# EAGLE design 4ButtonSwitch.Rev2.2 (EAGLE 8.6.0)
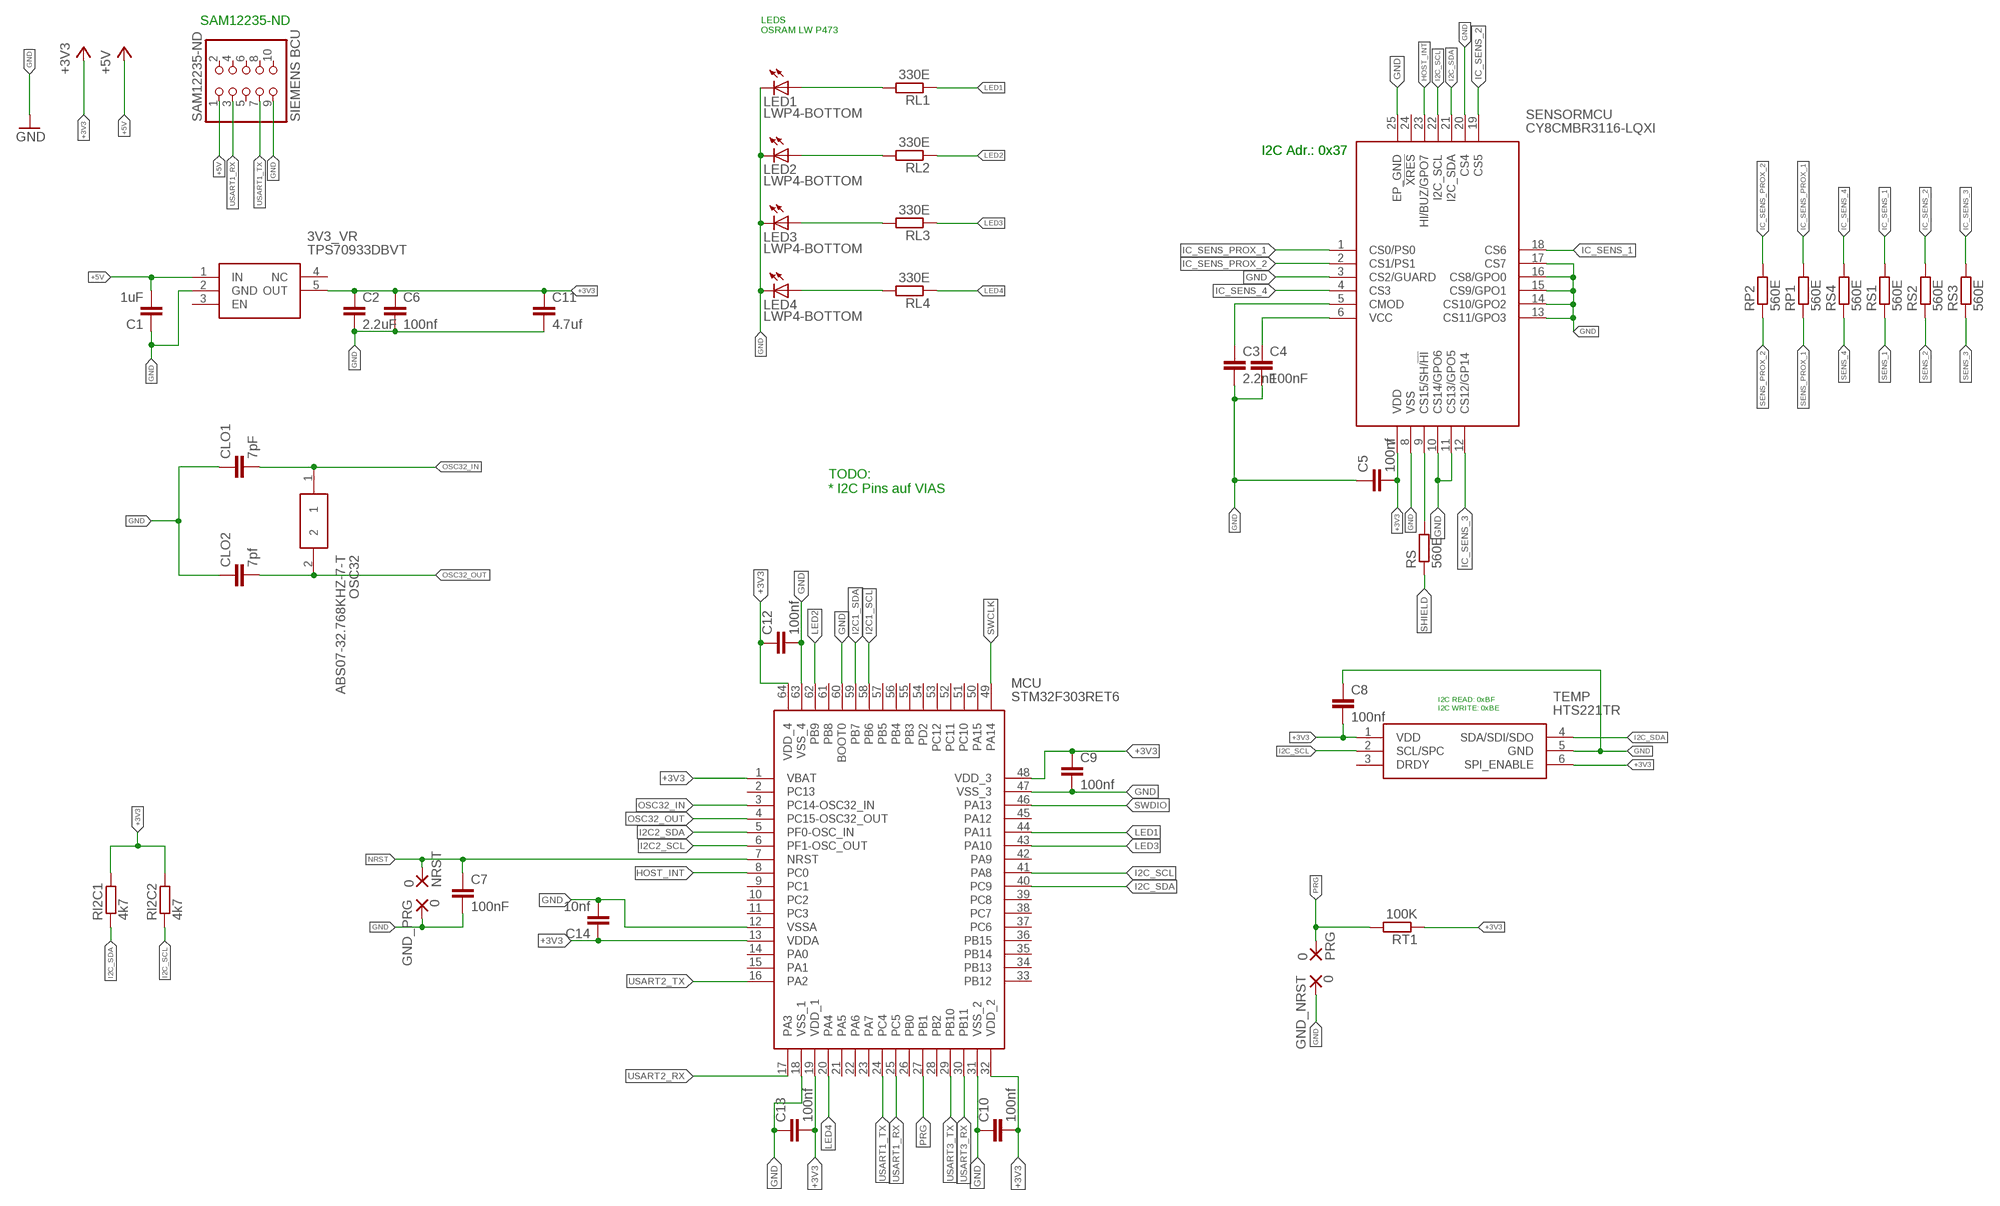
[diagram p0: schematic, sheet 1]

## Parts
3V3_VR  TPS70933DBVT  [SOT95P280X145-5N]
C1  1uF  C-EUC0402  [C0402]
C2  2.2uF  C-EUC0402  [C0402]
C3  2.2nF  C-EUC0402  [C0402]
C4  100nF  C-EUC0402  [C0402]
C5  100nf  C-EUC0402  [C0402]
C6  100nf  C-EUC0402  [C0402]
C7  100nF  C-EUC0402  [C0402]
C8  100nf  C-EUC0402  [C0402]
C9  100nf  C-EUC0402  [C0402]
C10  100nf  C-EUC0402  [C0402]
C11  4.7uf  C-EUC0402  [C0402]
C12  100nf  C-EUC0402  [C0402]
C13  100nf  C-EUC0402  [C0402]
C14  10nf  C-EUC0402  [C0402]
CLO1  7pF  C-EUC0402  [C0402]
CLO2  7pf  C-EUC0402  [C0402]
GND_NRST  0  SMD5  [SMD2,54-5,08]
GND_PRG  0  SMD5  [SMD2,54-5,08]
LED1  LWP4-BOTTOM  [P47F-BOTTOM]
LED2  LWP4-BOTTOM  [P47F-BOTTOM]
LED3  LWP4-BOTTOM  [P47F-BOTTOM]
LED4  LWP4-BOTTOM  [P47F-BOTTOM]
MCU  STM32F303RET6  [QFP50P1200X1200X160-64N]
NRST  0  SMD5  [SMD2,54-5,08]
OSC32  ABS07-32.768KHZ-7-T  [ABS-07]
PRG  0  SMD5  [SMD2,54-5,08]
RI2C1  4k7  R-EU_R0402  [R0402]
RI2C2  4k7  R-EU_R0402  [R0402]
RL1  330E  R-EU_R0402  [R0402]
RL2  330E  R-EU_R0402  [R0402]
RL3  330E  R-EU_R0402  [R0402]
RL4  330E  R-EU_R0402  [R0402]
RP1  560E  R-EU_R0402  [R0402]
RP2  560E  R-EU_R0402  [R0402]
RS  560E  R-EU_R0402  [R0402]
RS1  560E  R-EU_R0402  [R0402]
RS2  560E  R-EU_R0402  [R0402]
RS3  560E  R-EU_R0402  [R0402]
RS4  560E  R-EU_R0402  [R0402]
RT1  100K  R-EU_R0402  [R0402]
SAM12235-ND  SIEMENS BCU  PINHD-2X5_2.54-SMD  [2X05SMD]
SENSORMCU  CY8CMBR3116-LQXI  [QFN50P400X400X60-25N]
TEMP  HTS221TR  [HLGA-6L]

## Nets
+3V3: 3V3_VR.5(OUT) C2.1 C5.2 C6.1 C8.2 C9.1 C10.2 C11.1 C12.1 C13.2 C14.1 MCU.1(VBAT) MCU.13(VDDA) MCU.19(VDD_1) MCU.32(VDD_2) MCU.48(VDD_3) MCU.64(VDD_4) RI2C1.2 RI2C2.2 RT1.1 SENSORMCU.7(VDD) TEMP.1(VDD) TEMP.6(SPI_ENABLE)
+5V: 3V3_VR.1(IN) C1.2 SAM12235-ND.1
CMOD: C3.1 SENSORMCU.5(CMOD)
GND: 3V3_VR.2(GND) C1.1 C2.2 C3.2 C4.2 C5.1 C6.2 C7.2 C8.1 C9.2 C10.1 C11.2 C12.2 C13.1 C14.2 CLO1.1 CLO2.1 GND_NRST.1(P) GND_PRG.1(P) LED1.C LED2.C LED3.C LED4.C MCU.12(VSSA) MCU.18(VSS_1) MCU.31(VSS_2) MCU.47(VSS_3) MCU.60(BOOT0) MCU.63(VSS_4) SAM12235-ND.9 SENSORMCU.3(CS2/GUARD) SENSORMCU.8(VSS) SENSORMCU.10(CS14/GPO6) SENSORMCU.11(CS13/GPO5) SENSORMCU.13(CS11/GPO3) SENSORMCU.14(CS10/GPO2) SENSORMCU.15(CS9/GPO1) SENSORMCU.16(CS8/GPO0) SENSORMCU.17(CS7) SENSORMCU.20(CS4) SENSORMCU.25(EP_GND) TEMP.5(GND)
HOST_INT: MCU.8(PC0) SENSORMCU.23(HI/BUZ/GPO7)
I2C1_SCL: MCU.58(PB6)
I2C1_SDA: MCU.59(PB7)
I2C2_SCL: MCU.6(PF1-OSC_OUT)
I2C2_SDA: MCU.5(PF0-OSC_IN)
I2C_SCL: MCU.41(PA8) RI2C2.1 SENSORMCU.22(I2C_SCL) TEMP.2(SCL/SPC)
I2C_SDA: MCU.40(PC9) RI2C1.1 SENSORMCU.21(I2C_SDA) TEMP.4(SDA/SDI/SDO)
IC_SENS_1: RS1.2 SENSORMCU.18(CS6)
IC_SENS_2: RS2.2 SENSORMCU.19(CS5)
IC_SENS_3: RS3.2 SENSORMCU.12(CS12/GP14)
IC_SENS_4: RS4.2 SENSORMCU.4(CS3)
IC_SENS_PROX_1: RP1.2 SENSORMCU.1(CS0/PS0)
IC_SENS_PROX_2: RP2.2 SENSORMCU.2(CS1/PS1)
LED1: MCU.44(PA11) RL1.1
LED2: MCU.62(PB9) RL2.1
LED3: MCU.43(PA10) RL3.1
LED4: MCU.20(PA4) RL4.1
N$1: RS.2 SENSORMCU.9(CS15/SH/!HI)
N$19: LED1.A RL1.2
N$20: LED2.A RL2.2
N$21: LED3.A RL3.2
N$22: LED4.A RL4.2
NRST: C7.1 MCU.7(NRST) NRST.1(P)
OSC32_IN: CLO1.2 MCU.3(PC14-OSC32_IN) OSC32.1
OSC32_OUT: CLO2.2 MCU.4(PC15-OSC32_OUT) OSC32.2
PRG: MCU.27(PB1) PRG.1(P) RT1.2
SENS_1: RS1.1
SENS_2: RS2.1
SENS_3: RS3.1
SENS_4: RS4.1
SENS_PROX_1: RP1.1
SENS_PROX_2: RP2.1
SHIELD: RS.1
SWCLK: MCU.49(PA14)
SWDIO: MCU.46(PA13)
USART1_RX: MCU.25(PC5) SAM12235-ND.3
USART1_TX: MCU.24(PC4) SAM12235-ND.7
USART2_RX: MCU.17(PA3)
USART2_TX: MCU.16(PA2)
USART3_RX: MCU.30(PB11)
USART3_TX: MCU.29(PB10)
VCC: C4.1 SENSORMCU.6(VCC)
Unconnected: 3V3_VR.3(EN) 3V3_VR.4(NC) MCU.2(PC13) MCU.9(PC1) MCU.10(PC2) MCU.11(PC3) MCU.14(PA0) MCU.15(PA1) MCU.21(PA5) MCU.22(PA6) MCU.23(PA7) MCU.26(PB0) MCU.28(PB2) MCU.33(PB12) MCU.34(PB13) MCU.35(PB14) MCU.36(PB15) MCU.37(PC6) MCU.38(PC7) MCU.39(PC8) MCU.42(PA9) MCU.45(PA12) MCU.50(PA15) MCU.51(PC10) MCU.52(PC11) MCU.53(PC12) MCU.54(PD2) MCU.55(PB3) MCU.56(PB4) MCU.57(PB5) MCU.61(PB8) SAM12235-ND.2 SAM12235-ND.4 SAM12235-ND.5 SAM12235-ND.6 SAM12235-ND.8 SAM12235-ND.10 SENSORMCU.24(!XRES) TEMP.3(DRDY)

## Notes on the sheet
- SAM12235-ND
- LEDS
  OSRAM LW P473
- I2C Adr.: 0x37 | I2C Adr.: 0x37
- TODO:
  * I2C Pins auf VIAS
- I2C READ: 0xBF
  I2C WRITE: 0xBE

## Library data of the parts
3V3_VR = TPS70933DBVT:TPS70933DBVT: 150mA 30V Ultra-Low-Iq Wide-Input Low-Dropout (LDO) Regulator With Reverse Current Protection Source: Datasheet <http://www.ti.com/lit/gpn/tps709>; ARROW_PART_NUMBER: TPS70933DBVT; ARROW_PRICE-STOCK: https://www.arrow.com/en/products/tps70933dbvt/texas-instruments; DESCRIPTION: 150mA 30V Ultra-Low-Iq Wide-Input Low-Dropout (LDO) Regulator With Reverse Current Protection; HEIGHT: 1.45mm; MANUFACTURER_NAME: Texas Instruments; MANUFACTURER_PART_NUMBER: TPS70933DBVT; RS_PART_NUMBER: 8257033P; RS_PRICE-STOCK: http://uk.rs-online.com/web/p/products/8257033P
C1-C14 CLO1 CLO2 = rcl:C-EU: CAPACITOR, European symbol; SPICEPREFIX: C
GND_NRST GND_PRG NRST PRG = wirepad:SMD5: SMD PAD
LED1-LED4 = led:*P4: PointLED® Enhanced Thinfilm LED TOP & BOTTOM mount LS P47F, LR P47F, LA P47F, LY P47F, LT P4SG, LB P4SG, LW P4SG Source: http://catalog.osram-os.com .. LA_LR_LS_LY_P47F_Pb_free.pdf
MCU = STM32F303RET6:STM32F303RET6: MCU+FPU 32-Bit Cortex-M4 512KB LQFP64 Source: Datasheet <http://www.st.com/content/ccc/resource/technical/document/datasheet/2c/6f/d7/64/1f/a3/4f/c9/DM00118585.pdf/files/DM00118585.pdf/jcr:content/translations/en.DM00118585.pdf>; ARROW_PART_NUMBER: STM32F303RET6; ARROW_PRICE/STOCK: https://www.arrow.com/en/products/stm32f303ret6/stmicroelectronics; DESCRIPTION: MCU+FPU 32-Bit Cortex-M4 512KB LQFP64; HEIGHT: 1.6mm; MANUFACTURER_NAME: STMicroelectronics; MANUFACTURER_PART_NUMBER: STM32F303RET6; RS_PART_NUMBER: 1458887; RS_PRICE/STOCK: http://uk.rs-online.com/web/p/products/1458887
OSC32 = ABS07-32.768KHZ-7-T:ABS07-32.768KHZ-7-T: ABRACON - ABS07-32.768KHZ-7-T - CRYSTAL, 32.768KHZ, 7PF, SMD Source: Datasheet <https://componentsearchengine.com/Datasheets/2/ABS07-32.768KHZ-7-T.pdf>; ARROW_PART_NUMBER: ABS07-32.768KHZ-7-T; ARROW_PRICE/STOCK: https://www.arrow.com/en/products/abs07-32.768khz-7-t/abracon; DESCRIPTION: ABRACON - ABS07-32.768KHZ-7-T - CRYSTAL, 32.768KHZ, 7PF, SMD; HEIGHT: mm; MANUFACTURER_NAME: ABRACON; MANUFACTURER_PART_NUMBER: ABS07-32.768KHZ-7-T; RS_PART_NUMBER: 1712773P; RS_PRICE/STOCK: http://uk.rs-online.com/web/p/products/1712773P
RI2C1 RI2C2 RL1-RL4 RP1 RP2 RS RS1-RS4 RT1 = resistor:R-EU_: RESISTOR, European symbol
SAM12235-ND = pinhead:PINHD-2X5: PIN HEADER
SENSORMCU = CY8CMBR3116-LQXI:CY8CMBR3116-LQXI: Touch Screen Controllers CapSense Express 16 Buttons Source: Datasheet <http://www.cypress.com/file/46236/download.pdf>; ARROW_PART_NUMBER: CY8CMBR3116-LQXI; ARROW_PRICE/STOCK: https://www.arrow.com/en/products/cy8cmbr3116-lqxi/cypress-semiconductor; DESCRIPTION: Touch Screen Controllers CapSense Express 16 Buttons; HEIGHT: 0.6mm; MANUFACTURER_NAME: Cypress Semiconductor; MANUFACTURER_PART_NUMBER: CY8CMBR3116-LQXI; RS_PART_NUMBER: 1242976P; RS_PRICE/STOCK: http://uk.rs-online.com/web/p/products/1242976P
TEMP = HTS221TR:HTS221TR: Humidity and Temperature Sensor HLGA6 STMicroelectronics HTS221TR Temperature & Humidity Sensor, -40 +120 C, 6-Pin HLGA Source: Datasheet <http://www.st.com/content/ccc/resource/technical/document/datasheet/4d/9a/9c/ad/25/07/42/34/DM00116291.pdf/files/DM00116291.pdf/jcr:content/translations/en.DM00116291.pdf>; ARROW_PART_NUMBER: HTS221TR; ARROW_PRICE/STOCK: https://www.arrow.com/en/products/hts221tr/stmicroelectronics; DESCRIPTION: Humidity and Temperature Sensor HLGA6 STMicroelectronics HTS221TR Temperature & Humidity Sensor, -40 +120 C, 6-Pin HLGA; HEIGHT: mm; MANUFACTURER_NAME: STMicroelectronics; MANUFACTURER_PART_NUMBER: HTS221TR; RS_PART_NUMBER: 1660935; RS_PRICE/STOCK: http://uk.rs-online.com/web/p/products/1660935

## Board
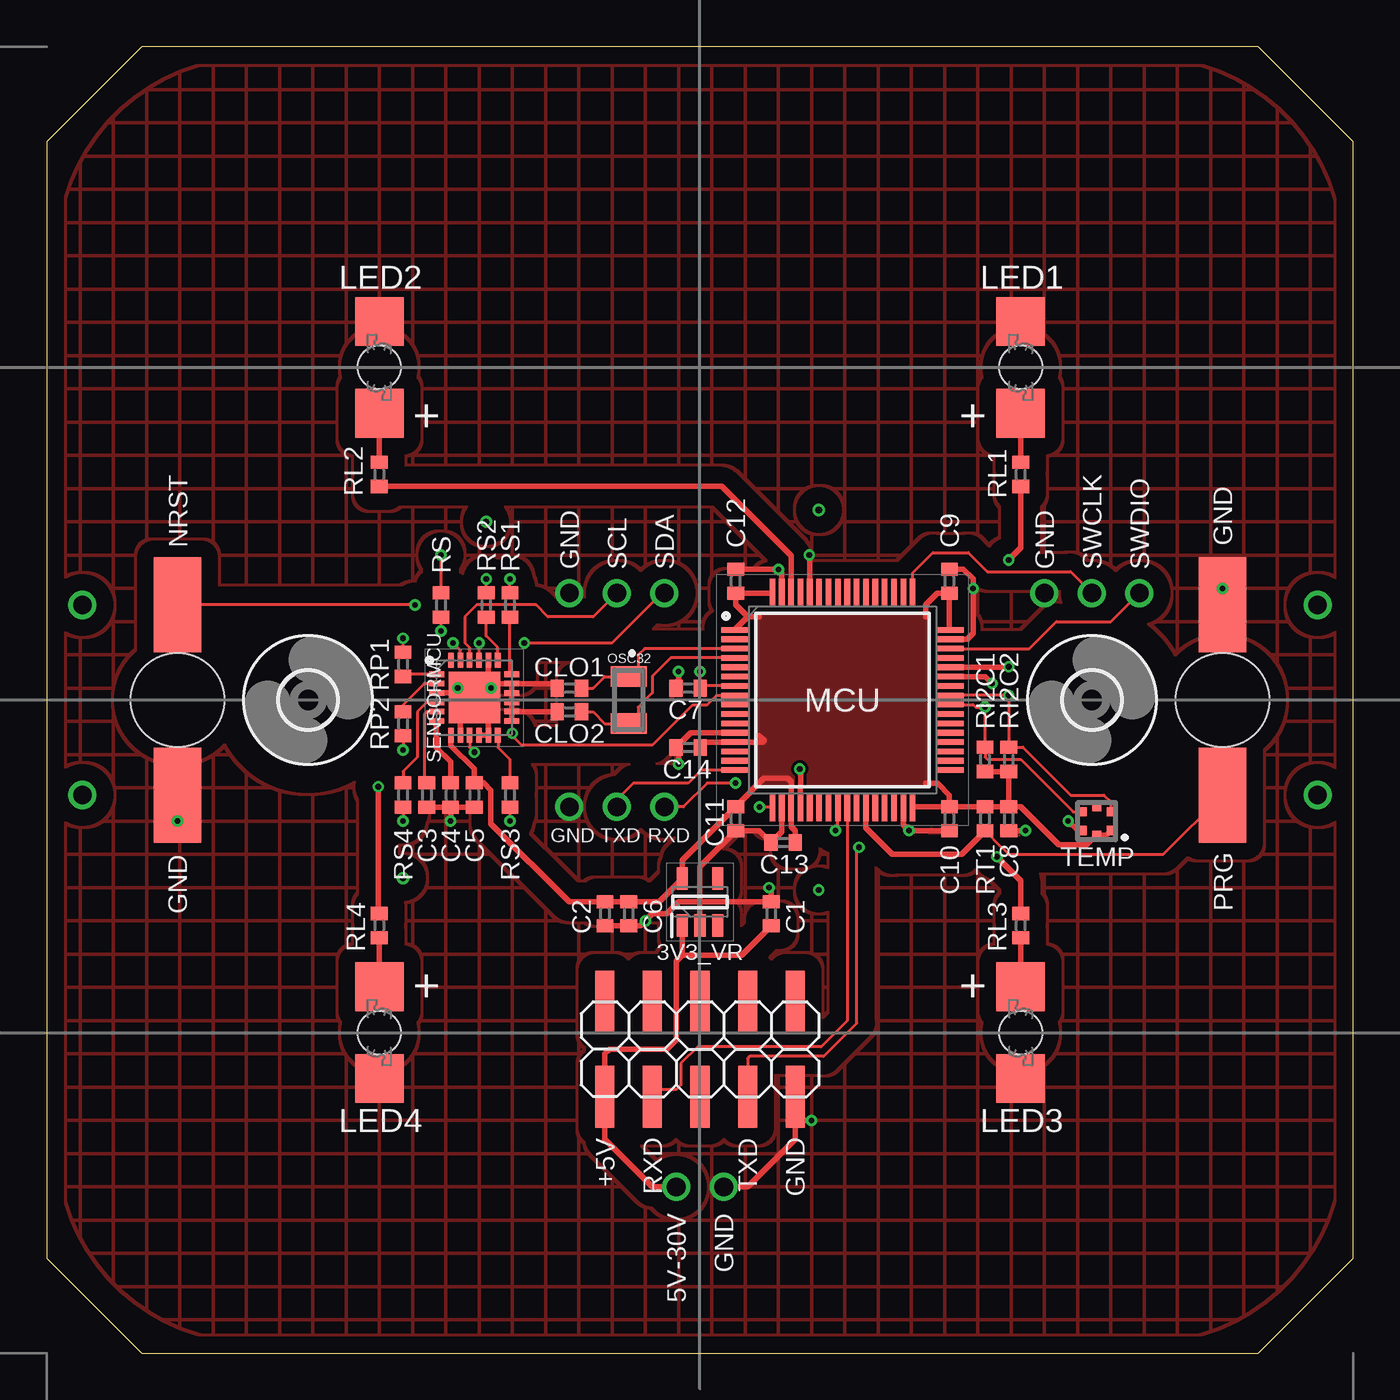
[diagram p1: board, top side]
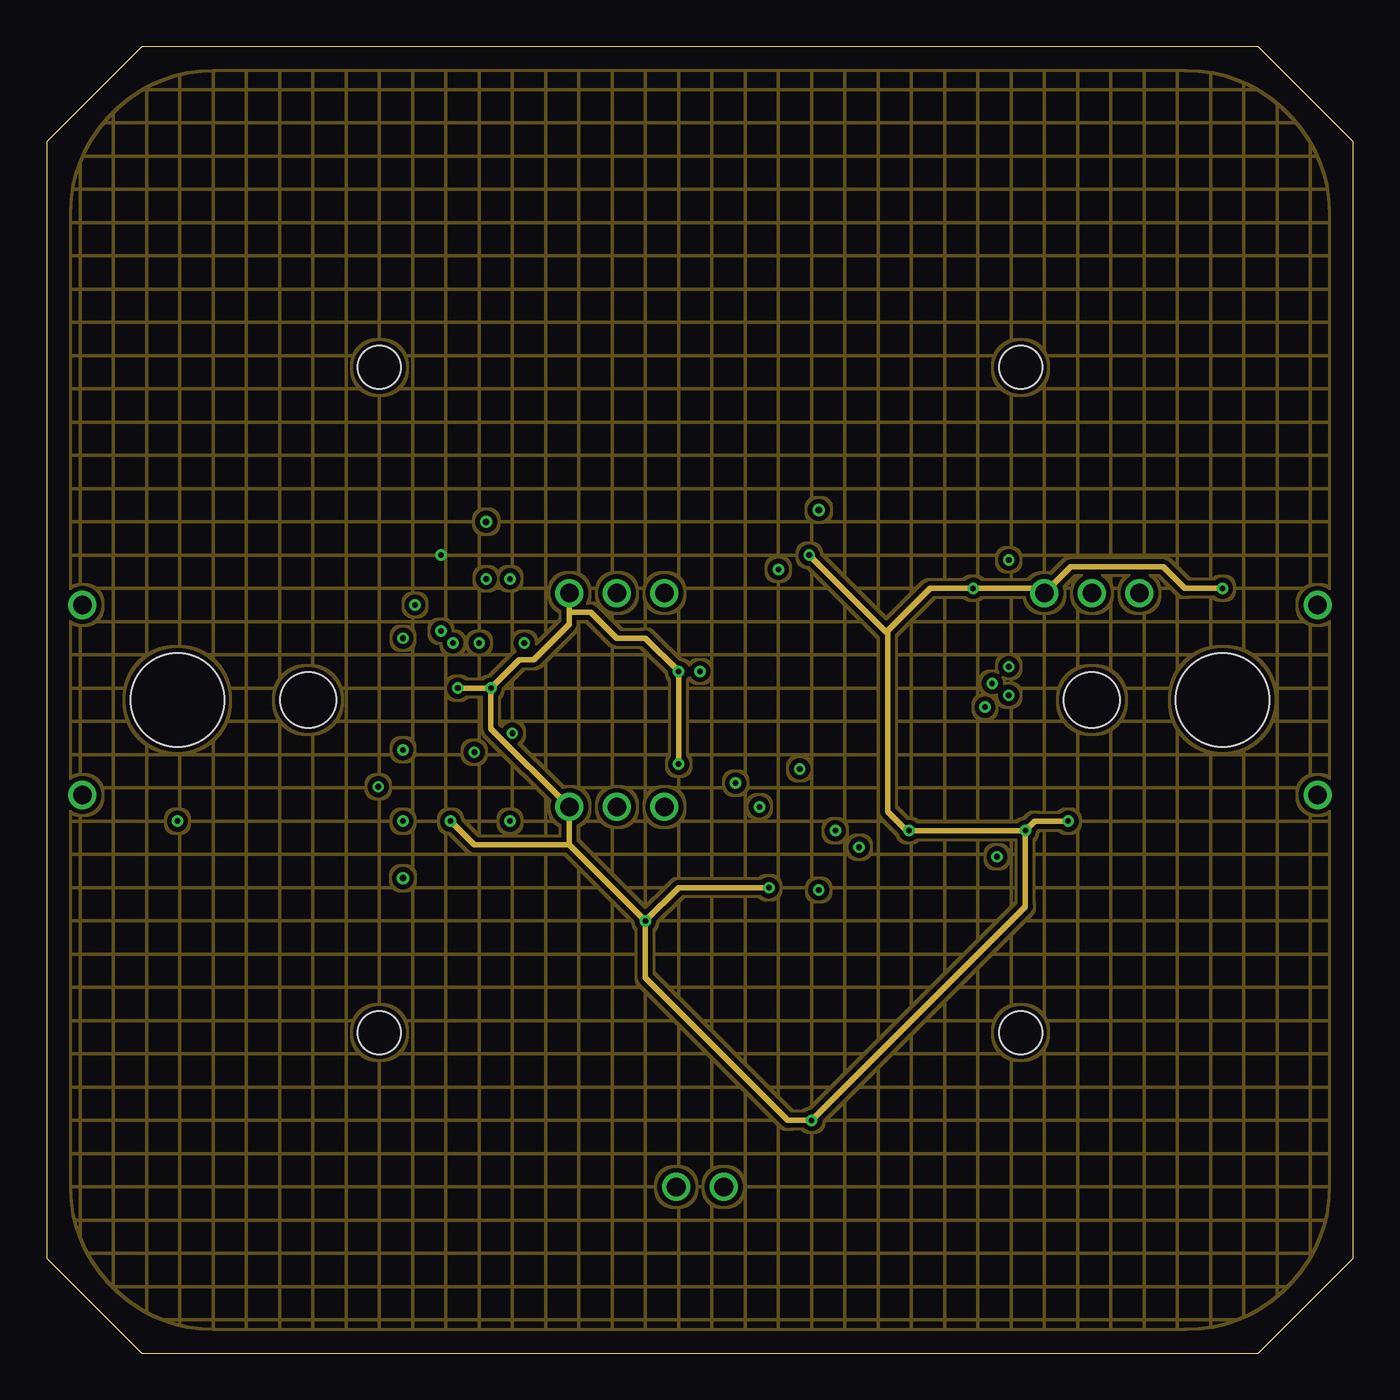
[diagram p2: board, inner layer Route2]
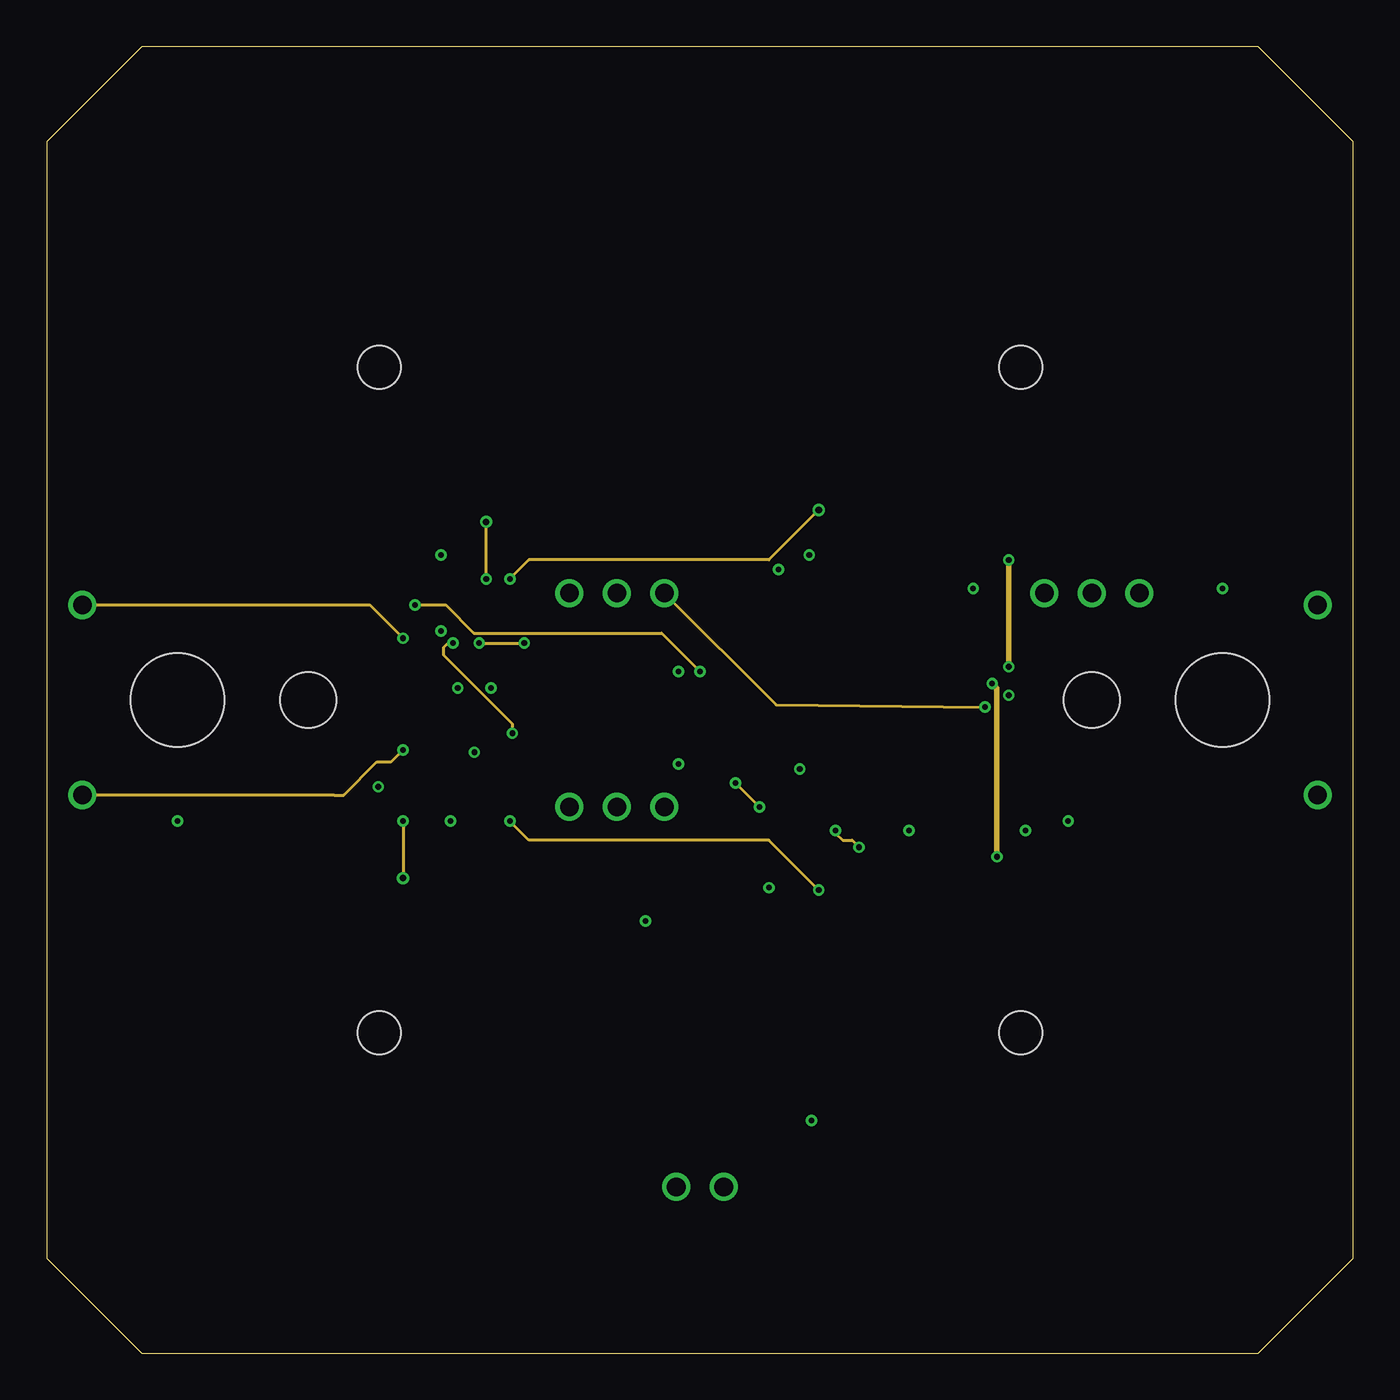
[diagram p3: board, inner layer Route15]
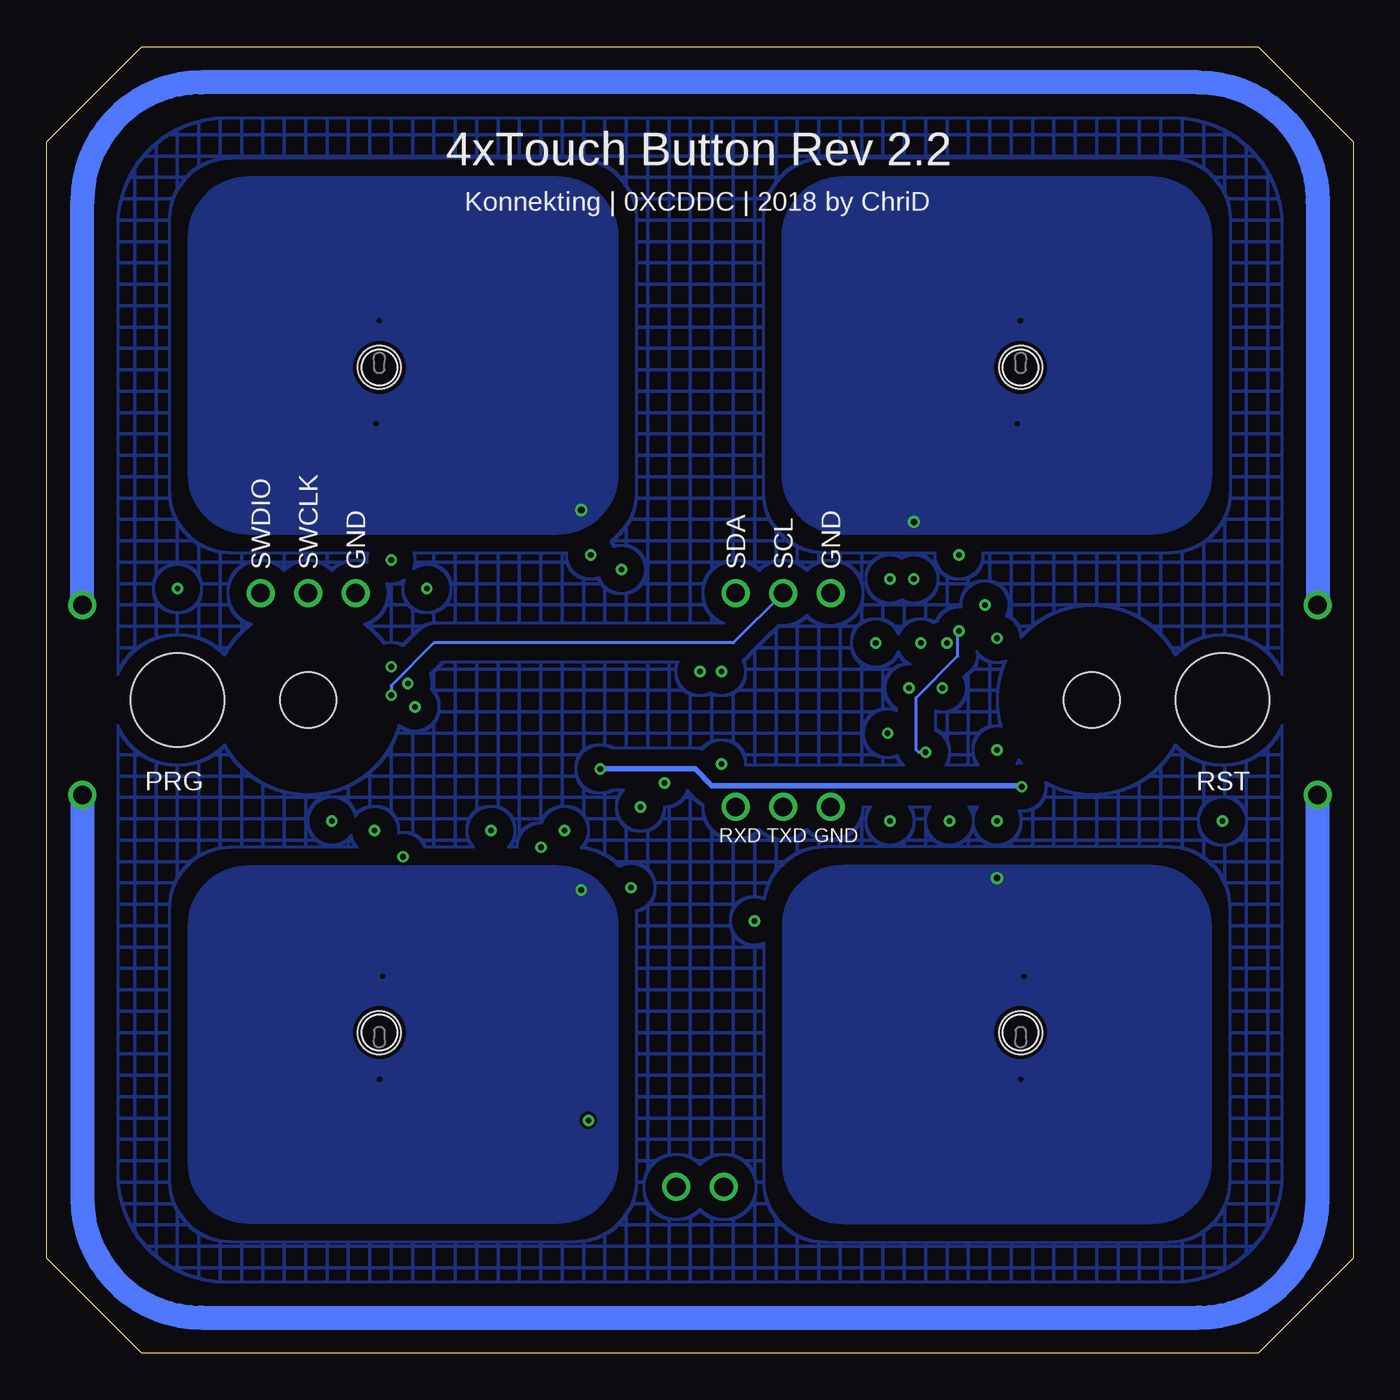
[diagram p4: board, bottom side, seen from below]

Size 69.85 x 69.85 mm. Coordinates in mm from the lower left corner, seen from the top.
Outline: 5.08,69.85 64.77,69.85 69.85,64.77 69.85,5.08 64.77,0 5.08,0 0,5.08 0,64.77 5.08,69.85
Outline: 6.34,69.84 5.08,69.85
Copper layers (1*2*15*16): Top 0.035mm / dielectric 0.23mm / Route2 0.035mm / dielectric 0.93mm / Route15 0.035mm / dielectric 0.23mm / Bottom 0.035mm
Design rules "MF_4_mil_drill_4_Layer *": minimum track width 5mil, minimum drill 5mil, track to track 6mil, track to pad 6mil, pad to pad 6mil, via to via 6mil, smd to smd 0mil, copper to edge 10mil, drill to drill 10mil, minimum pad ring 6mil, minimum via ring 6mil, stop-mask expansion 2mil, vias tented up to drill 25mil, thermal gap 10mil
Holes 5 mm at 62.87,34.92 6.99,34.92

### Footprints (pad centres in the part's own frame; a part is rotated, then mirrored left to right if it is on the bottom)
SOT95P280X145-5N = smd 1.2 x 0.6: 1 -1.25,0.95; 2 -1.25,0; 3 -1.25,-0.95; 4 1.25,-0.95; 5 1.25,0.95
C0402 = smd 0.7 x 0.9: 1 -0.65,0; 2 0.65,0
SMD2,54-5,08 = smd 2.54 x 5.08: 1 0,0
P47F-BOTTOM = smd 2.6 x 2.6: A -2.45,0; C 2.45,0 | hole 2.3: 0,0
QFP50P1200X1200X160-64N = smd 1.475 x 0.3: 1 -5.738,3.75; 2 -5.738,3.25; 3 -5.738,2.75; 4 -5.738,2.25; 5 -5.738,1.75; 6 -5.738,1.25; 7 -5.738,0.75; 8 -5.738,0.25; 9 -5.738,-0.25; 10 -5.738,-0.75; 11 -5.738,-1.25; 12 -5.738,-1.75; 13 -5.738,-2.25; 14 -5.738,-2.75; 15 -5.738,-3.25; 16 -5.738,-3.75; 33 5.738,-3.75; 34 5.738,-3.25; 35 5.738,-2.75; 36 5.738,-2.25; 37 5.738,-1.75; 38 5.738,-1.25; 39 5.738,-0.75; 40 5.738,-0.25; 41 5.738,0.25; 42 5.738,0.75; 43 5.738,1.25; 44 5.738,1.75; 45 5.738,2.25; 46 5.738,2.75; 47 5.738,3.25; 48 5.738,3.75 | smd 0.3 x 1.475: 17 -3.75,-5.738; 18 -3.25,-5.738; 19 -2.75,-5.738; 20 -2.25,-5.738; 21 -1.75,-5.738; 22 -1.25,-5.738; 23 -0.75,-5.738; 24 -0.25,-5.738; 25 0.25,-5.738; 26 0.75,-5.738; 27 1.25,-5.738; 28 1.75,-5.738; 29 2.25,-5.738; 30 2.75,-5.738; 31 3.25,-5.738; 32 3.75,-5.738; 49 3.75,5.738; 50 3.25,5.738; 51 2.75,5.738; 52 2.25,5.738; 53 1.75,5.738; 54 1.25,5.738; 55 0.75,5.738; 56 0.25,5.738; 57 -0.25,5.738; 58 -0.75,5.738; 59 -1.25,5.738; 60 -1.75,5.738; 61 -2.25,5.738; 62 -2.75,5.738; 63 -3.25,5.738; 64 -3.75,5.738
ABS-07 = smd 1.1 x 1.9: 1 -1.25,0; 2 1.25,0
R0402 = smd 0.7 x 0.9: 1 -0.65,0; 2 0.65,0
2X05SMD = smd 1.016 x 3.302: 1 -1.27,-3.81; 2 -1.27,1.27; 3 1.27,-3.81; 4 1.27,1.27; 5 3.81,-3.81; 6 3.81,1.27; 7 6.35,-3.81; 8 6.35,1.27; 9 8.89,-3.81; 10 8.89,1.27
QFN50P400X400X60-25N = smd 0.8 x 0.3: 1 -2,1.25; 2 -2,0.75; 3 -2,0.25; 4 -2,-0.25; 5 -2,-0.75; 6 -2,-1.25; 13 2,-1.25; 14 2,-0.75; 15 2,-0.25; 16 2,0.25; 17 2,0.75; 18 2,1.25 | smd 0.3 x 0.8: 7 -1.25,-2; 8 -0.75,-2; 9 -0.25,-2; 10 0.25,-2; 11 0.75,-2; 12 1.25,-2; 19 1.25,2; 20 0.75,2; 21 0.25,2; 22 -0.25,2; 23 -0.75,2; 24 -1.25,2 | smd 2.75 x 2.75: 25 0,0
HLGA-6L = smd 0.45 x 0.5: 1 -0.75,0.5; 2 -0.75,-0.5; 4 0.75,-0.5; 5 0.75,0.5 | smd 0.5 x 0.45: 3 0,-0.75; 6 0,0.75
3,0 = hole 3: 0,0

### Placement (x,y rotation side)
3V3_VR  34.92,24.13 90 top
C1  38.73,23.5 270 top
C2  29.84,23.5 270 top
C3  20.32,29.84 270 top
C4  21.59,29.84 270 top
C5  22.86,29.84 90 top
C6  31.11,23.5 270 top
C7  34.29,35.56 180 top
C8  51.44,28.57 90 top
C9  48.26,41.27 90 top
C10  48.26,28.57 90 top
C11  36.83,28.57 270 top
C12  36.83,41.27 90 top
C13  39.37,27.3 0 top
C14  34.29,32.38 180 top
CLO1  27.94,35.56 0 top
CLO2  27.94,34.29 0 top
GND_NRST  6.99,29.84 0 top
GND_PRG  62.87,40.01 0 top
LED1  52.07,52.7 90 top
LED2  17.78,52.7 90 top
LED3  52.07,17.14 270 top
LED4  17.78,17.14 270 top
MCU  42.55,34.92 0 top
NRST  6.99,40.01 0 top
OSC32  31.11,34.92 270 top
PRG  62.87,29.84 0 top
RI2C1  50.16,31.75 270 top
RI2C2  51.44,31.75 270 top
RL1  52.07,46.99 90 top
RL2  17.78,46.99 90 top
RL3  52.07,22.86 270 top
RL4  17.78,22.86 270 top
RP1  19.05,36.83 270 top
RP2  19.05,33.66 90 top
RS  21.08,40.01 270 top
RS1  24.77,40.01 270 top
RS2  23.5,40.01 270 top
RS3  24.77,29.84 90 top
RS4  19.05,29.84 90 top
RT1  50.16,28.57 270 top
SAM12235-ND  31.11,17.53 0 top
SENSORMCU  22.86,35.05 0 top
TEMP  56.13,28.45 180 top
U$1  [3,0]  13.97,34.92 0 top
U$2  [3,0]  55.88,34.92 0 top

### Tracks (layer width: path | path; a pad name or v marks a point on that pad's centre or on a via)
+3V3
  Top 0.305: MCU.48 48.26,38.7 C9.1 47.61,40.62 46.99,40.01 46.99,39.37 | C10.2 46.33,29.23 MCU.32 | C10.2 48.26,29.84 47.62,30.48 46.99,30.48 | MCU.64 38.76,40.62 C12.1 36.83,40.01 37.47,39.37 | 37.47,39.37 38.1,39.37 | C10.2 RT1.1 C8.2 | C14.1 35.23,32.67 MCU.13 38.26,32.67 38.35,32.77 38.1,33.02 | RI2C1.2 RI2C2.2 C8.2 | MCU.1 36.81,38.71 37.47,39.37 | SENSORMCU.7 21.61,32.49 22.86,31.24 C5.2 23.35,30.5 23.75,30.1 23.75,28.32 27.93,24.14 C2.1 C6.1 32.74,24.14 3V3_VR.5 33.98,26.37 C11.1 38.34,30.73 38.35,30.73 39.62,30.73 39.8,30.56 MCU.19 39.8,28.15 40.02,27.93 C13.2 | C8.2 52.07,29.21 54.1,27.18 55.61,27.18 TEMP.6 56.63,27.7 TEMP.1
  pour Top: 38.1,39.37 38.1,30.48 46.99,30.48 46.99,39.37
+5V  (via drill 1)
  Top 0.305: C1.2 37.16,21.27 33.98,21.27 | 3V3_VR.1 33.98,21.27 | 33.98,21.27 33.66,20.95 33.66,16.76 33.15,16.26 30.1,16.26 29.84,16 SAM12235-ND.1 29.84,11.43 32.38,8.89 v33.66,8.89
CMOD
  Top 0.152: SENSORMCU.5 20.85,34.29 20.32,34.29 20.19,34.16 20.19,30.62 C3.1
GND  (via drill 0.3, 1)
  Top 0.305: 40.01,13.34 SAM12235-ND.9 40.01,11.43 37.47,8.89 v36.2,8.89 | C2.2 C6.2 31.73,22.84 v32,23.11 32.38,23.5 33.15,23.5 33.78,24.13 34.92,24.13 | GND_NRST.1 v6.99,28.45 | GND_PRG.1 v62.87,40.89 | MCU.47 49.22,38.17 49.53,38.48 v49.53,40.89 49.53,41.4 49.01,41.92 C9.2 | MCU.60 40.8,42.64 v40.77,42.67 | MCU.12 34.43,33.17 C14.2 33.78,32.24 v33.78,31.5 | C3.2 C4.2 | C4.2 C5.1 | 36.42,27.52 C11.2 | v38.61,24.89 38.73,24.77 C1.1 34.92,24.13 | SENSORMCU.17 SENSORMCU.16 SENSORMCU.15 SENSORMCU.14 | SENSORMCU.14 SENSORMCU.13 | SENSORMCU.10 SENSORMCU.11 23.61,35.42 v23.75,35.56 | SENSORMCU.3 21.71,35.3 v21.97,35.56 22.11,35.42 | SENSORMCU.20 23.61,35.7 v23.75,35.56 | SENSORMCU.17 23.99,35.8 v23.75,35.56 | SENSORMCU.8 22.11,35.42 | SENSORMCU.25 22.49,35.42 22.11,35.42 | C4.2 v21.59,28.45 | SENSORMCU.17 27.05,35.8 CLO1.1 | SENSORMCU.14 27.28,34.3 CLO2.1 | C7.2 33.78,35.7 v33.78,36.45 | TEMP.5 55.11,27.95 v54.61,28.45 | C8.1 52.31,27.93 v52.32,27.94 | 36.97,41.78 C12.2 36.84,41.91 v39.12,41.91 39.3,41.73 MCU.63 | C10.1 46.24,27.93 v46.1,27.94 45.8,28.25 MCU.31 | C11.2 38.1,27.93 C13.1 39.3,27.88 MCU.18 | v40.89,12.45 39.88,12.45 | 3V3_VR.2 34.92,24.13 | 34.92,24.13 34.92,26.02 C11.2
  Route2 0.305: v52.32,27.94 52.83,28.45 v54.61,28.45 | v52.32,27.94 52.32,23.88 v40.89,12.45 39.62,12.45 32,20.07 v32,23.11 | v52.32,27.94 v46.1,27.94 45.97,27.94 44.96,28.96 44.96,38.48 44.9,38.54 | v38.61,24.89 33.78,24.89 v32,23.11 | v32,23.11 27.94,27.18 | 27.94,27.18 v27.94,29.21 23.75,33.4 v23.75,35.56 | v23.75,35.56 v21.97,35.56 | v21.59,28.45 22.86,27.18 27.94,27.18 | 27.93,39.62 27.94,39.63 v27.94,40.64 | 44.9,38.54 v40.77,42.67 | 44.9,38.54 47.24,40.89 v49.53,40.89 53.09,40.89 v53.34,40.64 54.74,42.04 59.69,42.04 60.83,40.89 v62.87,40.89 | v33.78,31.5 v33.78,36.45 32,38.23 30.48,38.23 29.08,39.62 27.93,39.62 | 27.93,39.62 27.93,38.98 26.04,37.08 25.27,37.08 v23.75,35.56
  pour Top (isolate 0.889, rank 6, no thermals, hatched): 0.64,10.79 arc90 10.79,0.64 59.05,0.64 arc90 69.22,10.79 69.22,59.05 arc90 59.05,69.22 10.79,69.22 arc90 0.64,59.05
HOST_INT  (via drill 0.3)
  Top 0.152: 22.1,37.06 SENSORMCU.23 22.11,37.58 v21.72,37.97 | MCU.8 35.81,35.17 35.31,34.67 34.54,34.67 32.38,32.51 25.4,32.51 24.89,33.02 v24.89,33.15
  Route15 0.152: v21.72,37.97 21.46,37.97 21.21,37.72 21.21,37.34 24.89,33.66 v24.89,33.15
I2C_SCL  (via drill 0.3, 1)
  Top 0.152: SENSORMCU.22 22.61,37.72 22.36,37.98 22.36,39.38 22.99,40.01 26.16,40.01 26.8,39.37 29.21,39.37 v30.48,40.64 | MCU.41 v51.44,35.18 RI2C2.1 52.18,32.4 54.74,29.84 56.52,29.84 56.88,29.48 TEMP.2
  Bottom 0.152: v30.48,40.64 33.15,37.97 49.15,37.97 51.44,35.69 v51.44,35.18
I2C_SDA  (via drill 0.3, 1)
  Top 0.152: SENSORMCU.21 v23.11,37.96 v23.12,37.97 | v25.53,37.97 30.23,37.97 32.89,40.64 v33.02,40.64 | MCU.40 49.53,34.67 49.66,34.54 v50.16,34.54 RI2C1.1 50.16,31.88 50.29,31.75 52.07,31.75 54.87,28.95 TEMP.4
  Route15 0.152: v33.02,40.64 38.99,34.67 v50.16,34.54 | v23.12,37.97 v25.52,37.97 v25.53,37.97
IC_SENS_1
  Top 0.152: SENSORMCU.18 24.77,36.4 RS1.2
IC_SENS_2
  Top 0.152: SENSORMCU.19 24.11,37.74 23.5,38.35 RS2.2
IC_SENS_3
  Top 0.152: SENSORMCU.12 24.13,33.03 24.13,32.38 24.77,31.75 RS3.2
IC_SENS_4
  Top 0.152: SENSORMCU.4 20.32,34.8 19.81,34.29 19.81,31.88 19.05,31.11 RS4.2
IC_SENS_PROX_1
  Top 0.152: SENSORMCU.1 19.17,36.3 RP1.2
IC_SENS_PROX_2
  Top 0.152: SENSORMCU.2 20.18,35.8 19.05,34.67 RP2.2
LED1  (via drill 0.3)
  Top 0.305: MCU.44 51.41,36.67 v51.44,36.7 | v51.44,42.42 52.07,43.05 RL1.1
  Route15 0.305: v51.44,36.7 v51.44,42.42
LED2
  Top 0.305: MCU.62 39.8,42.63 36.08,46.34 RL2.1
LED3  (via drill 0.3)
  Top 0.305: MCU.43 50.19,36.17 v50.55,35.81 | v50.8,26.54 52.07,25.27 RL3.1
  Route15 0.305: v50.55,35.81 50.8,35.56 v50.8,26.54
LED4  (via drill 0.3)
  Top 0.305: v17.72,30.29 17.72,23.57 RL4.1 | MCU.20 40.3,30.29 40.31,30.3 40.31,31.19 v40.26,31.24
  Bottom 0.305: v40.26,31.24 35.18,31.24 34.29,30.35 17.79,30.35 v17.72,30.29
N$1  (via drill 0.3)
  Top 0.152: SENSORMCU.9 22.61,32.38 v22.86,32.13 | v21.08,38.61 RS.2
  Bottom 0.152: v22.86,32.13 23.24,32.13 23.37,32.26 23.37,35.05 21.13,37.29 21.13,38.56 v21.08,38.61
N$19
  Top 0.305: RL1.2 LED1.A
N$20
  Top 0.305: RL2.2 LED2.A
N$21
  Top 0.305: LED3.A RL3.2
N$22
  Top 0.305: LED4.A RL4.2
NRST  (via drill 0.3)
  Top 0.152: MCU.7 35.05,35.67 C7.1 | 34.92,35.55 C7.1 | C7.1 34.94,36.43 v34.92,36.45 | v19.68,40.01 NRST.1
  Route15 0.152: v19.68,40.01 21.34,40.01 22.84,38.5 32.87,38.5 v34.92,36.45
OSC32_IN
  Top 0.152: MCU.3 31.96,37.67 31.62,37.34 31.62,36.45 31.35,36.17 OSC32.1 29.82,36.17 29.21,35.56 CLO1.2
OSC32_OUT
  Top 0.152: OSC32.2 31.62,34.18 31.62,34.54 32.38,35.31 32.38,36.2 33.37,37.17 MCU.4 | OSC32.2 30.46,33.66 | CLO2.2 29.21,34.29 29.84,33.66 30.46,33.66 | 30.46,33.66 31.09,33.66 OSC32.2
PRG
  Top 0.152: 50.32,27.93 RT1.2 51.02,27.07 51.42,26.67 59.69,26.67 PRG.1
  Top 0.305: RT1.2 48.91,26.67 45.21,26.67 43.8,28.09 MCU.27
SENS_1  (via drill 0.3, 0.35)
  Top 0.152: RS1.1 v24.77,41.4
  Route15 0.152: v24.77,41.4 25.78,42.42 38.61,42.42 v41.27,45.09
  pour Bottom: 39.37,59.69 39.37,46.99 arc90 42.55,43.81 59.05,43.81 arc90 62.23,46.99 62.23,59.69 arc90 59.05,62.87 42.55,62.87 arc90
SENS_2  (via drill 0.3, 0.35)
  Top 0.152: RS2.1 v23.5,41.4
  Route15 0.152: v23.5,41.4 v23.5,44.45
  pour Bottom: 10.79,43.81 27.3,43.81 arc90 30.48,46.99 30.48,59.69 arc90 27.3,62.87 10.79,62.87 arc90 7.62,59.69 7.62,46.99 arc90
SENS_3  (via drill 0.3)
  Top 0.152: RS3.1 v24.77,28.45
  Route15 0.152: v24.77,28.45 25.78,27.43 38.61,27.43 v41.27,24.77
  pour Bottom: 59.05,26.04 42.55,26.04 arc90 39.37,22.86 39.37,10.16 arc90 42.55,6.99 59.05,6.99 arc90 62.23,10.16 62.23,22.86 arc90
SENS_4  (via drill 0.3, 0.35)
  Top 0.152: RS4.1 v19.05,28.45
  Route15 0.152: v19.05,28.45 v19.05,25.4
  pour Bottom: 7.62,10.16 7.62,22.86 arc-90 10.79,26.04 27.3,26.04 arc-90 30.48,22.86 30.48,10.16 arc-90 27.3,6.99 10.79,6.99 arc-90
SENS_PROX_1  (via drill 0.3, 1)
  Top 0.152: RP1.1 v19.05,38.23
  Route15 0.152: v1.91,40.01 17.27,40.01 v19.05,38.23
  Bottom 1.27: v1.91,40.01 1.91,61.59 arc-90 8.26,67.94 61.59,67.94 arc-90 67.94,61.59 v67.94,40.01
SENS_PROX_2  (via drill 0.3, 1)
  Top 0.152: RP2.1 v19.05,32.26
  Route15 0.152: v1.91,29.84 15.24,29.84 15.37,29.84 15.88,29.84 17.65,31.62 18.41,31.62 v19.05,32.26
  Bottom 1.27: v1.91,29.84 1.91,8.26 arc90 8.26,1.91 61.59,1.91 arc90 67.94,8.26 v67.94,29.84
SHIELD  (via drill 0.3)
  Top 0.152: RS.1 v21.08,42.67
  pour Route2 (isolate 0.254, rank 6, no thermals, hatched): 1.27,60.96 arc-90 8.89,68.58 60.96,68.58 arc-90 68.58,60.96 68.58,8.89 arc-90 60.96,1.27 8.89,1.27 arc-90 1.27,8.89
SHIELD_OR_GND
  pour Bottom (isolate 0.889, rank 6, no thermals, hatched): 3.81,9.53 arc90 9.53,3.81 60.33,3.81 arc90 66.04,9.53 66.04,60.33 arc90 60.33,66.04 9.53,66.04 arc90 3.81,60.33
SWCLK  (via drill 1)
  Top 0.152: MCU.49 46.3,41.72 47.37,42.8 49.28,42.8 50.29,41.78 54.74,41.78 v55.88,40.64
SWDIO  (via drill 1)
  Top 0.152: MCU.46 52.53,37.67 53.98,39.12 56.9,39.12 v58.42,40.64
USART1_RX
  Top 0.152: SAM12235-ND.3 32.64,13.97 32.77,14.1 33.66,14.1 33.91,14.35 33.91,15.49 34.8,16.38 41.4,16.38 42.8,17.78 MCU.25
USART1_TX  (via drill 0.3)
  Top 0.152: SAM12235-ND.7 37.34,13.84 37.34,14.73 37.47,14.86 37.47,15.75 37.59,15.88 41.53,15.88 43.31,17.65 43.31,26.92 v43.43,27.05 | v42.16,27.94 42.3,28.07 MCU.24
  Route15 0.152: v42.16,27.94 42.16,27.81 42.55,27.43 43.05,27.43 v43.43,27.05
USART2_RX  (via drill 0.3, 1)
  Top 0.152: MCU.17 38.12,29.19 v38.1,29.21 | v36.83,30.48 35.31,30.48 34.04,29.21 v33.02,29.21
  Route15 0.152: v38.1,29.21 v36.83,30.48
USART2_TX  (via drill 1)
  Top 0.152: MCU.16 34.98,31.18 34.29,30.48 31.37,30.48 30.48,29.59 v30.48,29.21
VCC
  Top 0.305: SENSORMCU.6 20.83,33.77 20.83,32.38 21.59,31.62 C4.1

### Text on the board
tNames: + | + | GND | GND | SCL | SDA | GND | SWCLK | SWDIO | GND | GND | TXD | RXD | + | + | +5V | RXD | TXD | GND | 5V-30V | GND
bNames: 4xTouch Button Rev 2.2 | Konnekting | 0XCDDC | 2018 by ChriD | GND | SCL | SDA | GND | SWCLK | SWDIO | PRG | RST | GND | TXD | RXD